# EAGLE design Schaltplan (EAGLE 7.2.0)
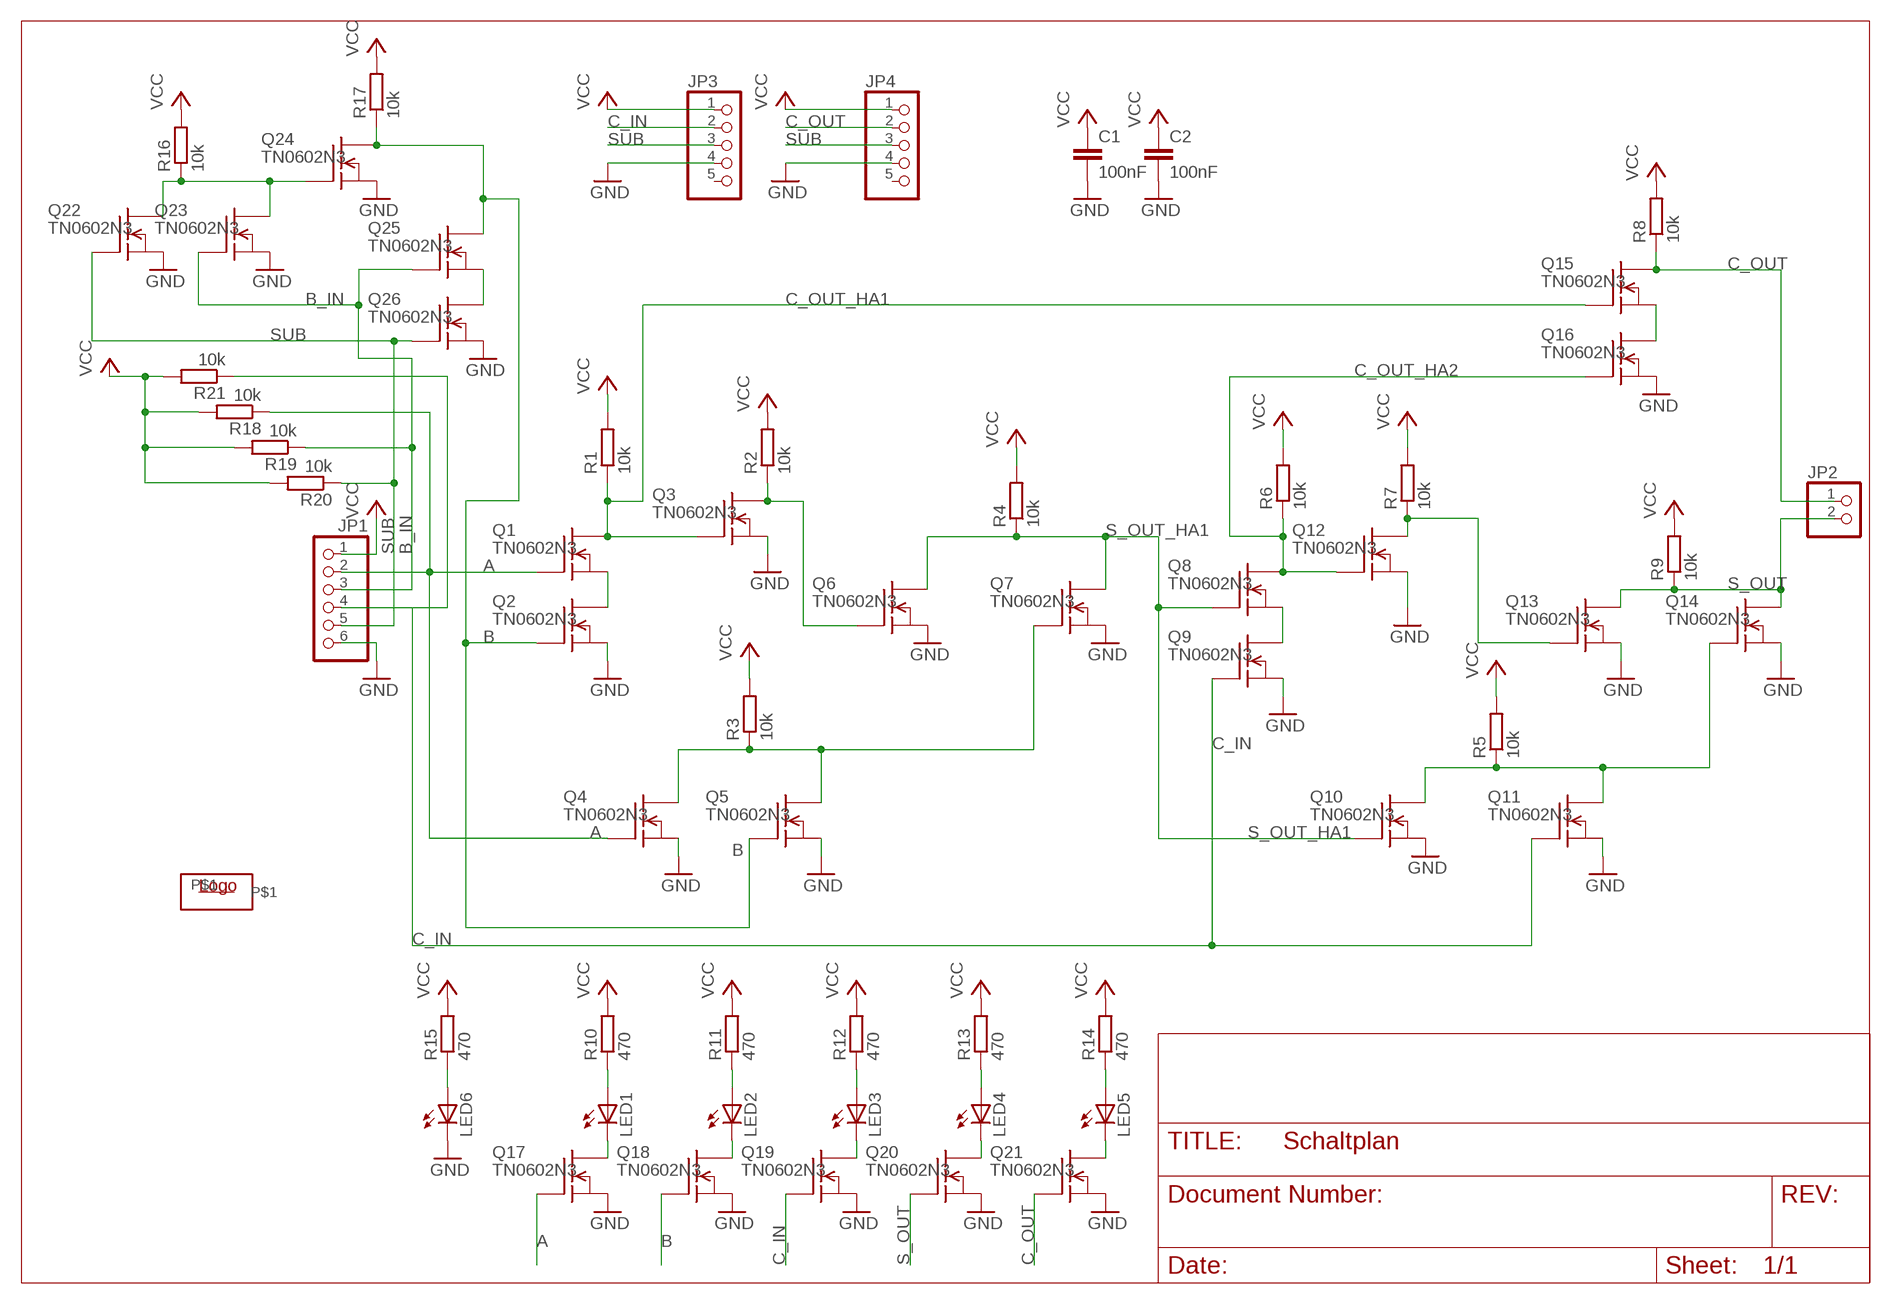
[diagram p0: schematic, sheet 1]

## Parts
C1  100nF  C-EU025-024X044  [C025-024X044]
C2  100nF  C-EU025-024X044  [C025-024X044]
JP1  PINHD-1X6  [1X06]
JP2  PINHD-1X2  [1X02]
JP3  PINHD-1X5  [1X05]
JP4  PINHD-1X5  [1X05]
LED1  LED3MM  [LED3MM]
LED2  LED3MM  [LED3MM]
LED3  LED3MM  [LED3MM]
LED4  LED3MM  [LED3MM]
LED5  LED3MM  [LED3MM]
LED6  LED3MM  [LED3MM]
Q1  TN0602N3  [TO-92]
Q2  TN0602N3  [TO-92]
Q3  TN0602N3  [TO-92]
Q4  TN0602N3  [TO-92]
Q5  TN0602N3  [TO-92]
Q6  TN0602N3  [TO-92]
Q7  TN0602N3  [TO-92]
Q8  TN0602N3  [TO-92]
Q9  TN0602N3  [TO-92]
Q10  TN0602N3  [TO-92]
Q11  TN0602N3  [TO-92]
Q12  TN0602N3  [TO-92]
Q13  TN0602N3  [TO-92]
Q14  TN0602N3  [TO-92]
Q15  TN0602N3  [TO-92]
Q16  TN0602N3  [TO-92]
Q17  TN0602N3  [TO-92]
Q18  TN0602N3  [TO-92]
Q19  TN0602N3  [TO-92]
Q20  TN0602N3  [TO-92]
Q21  TN0602N3  [TO-92]
Q22  TN0602N3  [TO-92]
Q23  TN0602N3  [TO-92]
Q24  TN0602N3  [TO-92]
Q25  TN0602N3  [TO-92]
Q26  TN0602N3  [TO-92]
R1  10k  R-EU_0204/2V  [0204V]
R2  10k  R-EU_0204/2V  [0204V]
R3  10k  R-EU_0204/2V  [0204V]
R4  10k  R-EU_0204/2V  [0204V]
R5  10k  R-EU_0204/2V  [0204V]
R6  10k  R-EU_0204/2V  [0204V]
R7  10k  R-EU_0204/2V  [0204V]
R8  10k  R-EU_0204/2V  [0204V]
R9  10k  R-EU_0204/2V  [0204V]
R10  470  R-EU_0204/2V  [0204V]
R11  470  R-EU_0204/2V  [0204V]
R12  470  R-EU_0204/2V  [0204V]
R13  470  R-EU_0204/2V  [0204V]
R14  470  R-EU_0204/2V  [0204V]
R15  470  R-EU_0204/2V  [0204V]
R16  10k  R-EU_0204/2V  [0204V]
R17  10k  R-EU_0204/2V  [0204V]
R18  10k  R-EU_M0805  [M0805]
R19  10k  R-EU_M0805  [M0805]
R20  10k  R-EU_M0805  [M0805]
R21  10k  R-EU_M0805  [M0805]
U$3  LOGO  [LOGO]

## Nets
A: JP1.2 Q1.2(G) Q4.2(G) Q17.2(G) R18.1
B: Q2.2(G) Q5.2(G) Q18.2(G) Q24.3(D) Q25.3(D) R17.1
B_IN: JP1.3 Q23.2(G) Q25.2(G) R19.1
C_IN: JP1.4 JP3.2 Q9.2(G) Q11.2(G) Q19.2(G) R21.1
C_OUT: JP2.1 JP4.2 Q15.3(D) Q21.2(G) R8.1
C_OUT_HA1: Q1.3(D) Q3.2(G) Q15.2(G) R1.1
C_OUT_HA2: Q8.3(D) Q12.2(G) Q16.2(G) R6.1
GND: C1.2 C2.2 JP1.6 JP3.4 JP4.4 LED6.K(C) Q2.1(S) Q3.1(S) Q4.1(S) Q5.1(S) Q6.1(S) Q7.1(S) Q9.1(S) Q10.1(S) Q11.1(S) Q12.1(S) Q13.1(S) Q14.1(S) Q16.1(S) Q17.1(S) Q18.1(S) Q19.1(S) Q20.1(S) Q21.1(S) Q22.1(S) Q23.1(S) Q24.1(S) Q26.1(S)
N$1: LED1.A R10.1
N$2: Q1.1(S) Q2.3(D)
N$3: Q3.3(D) Q6.2(G) R2.1
N$4: Q4.3(D) Q5.3(D) Q7.2(G) R3.1
N$5: LED1.K(C) Q17.3(D)
N$6: LED2.A R11.1
N$7: LED2.K(C) Q18.3(D)
N$8: LED3.A R12.1
N$9: LED3.K(C) Q19.3(D)
N$10: Q8.1(S) Q9.3(D)
N$11: Q12.3(D) Q13.2(G) R7.1
N$12: Q10.3(D) Q11.3(D) Q14.2(G) R5.1
N$13: LED4.A R13.1
N$14: Q15.1(S) Q16.3(D)
N$15: LED4.K(C) Q20.3(D)
N$16: LED5.A R14.1
N$17: LED5.K(C) Q21.3(D)
N$18: LED6.A R15.1
N$19: Q22.3(D) Q23.3(D) Q24.2(G) R16.1
N$21: Q25.1(S) Q26.3(D)
S_OUT: JP2.2 Q13.3(D) Q14.3(D) Q20.2(G) R9.1
S_OUT_HA1: Q6.3(D) Q7.3(D) Q8.2(G) Q10.2(G) R4.1
SUB: JP1.5 JP3.3 JP4.3 Q22.2(G) Q26.2(G) R20.1
VCC: C1.1 C2.1 JP1.1 JP3.1 JP4.1 R1.2 R2.2 R3.2 R4.2 R5.2 R6.2 R7.2 R8.2 R9.2 R10.2 R11.2 R12.2 R13.2 R14.2 R15.2 R16.2 R17.2 R18.2 R19.2 R20.2 R21.2
Unconnected: JP3.5 JP4.5 U$3.P$1

## Library data of the parts
C1 C2 = resistor:C-EU: CAPACITOR, European symbol
JP1 = pinhead:PINHD-1X6: PIN HEADER
JP2 = pinhead:PINHD-1X2: PIN HEADER
JP3 JP4 = pinhead:PINHD-1X5: PIN HEADER
LED1-LED6 = led:LED: LED OSRAM: - CHIPLED LG R971, LG N971, LY N971, LG Q971, LY Q971, LO R971, LY R971 LH N974, LH R974 LS Q976, LO Q976, LY Q976 LO Q996 - Hyper CHIPLED LW Q18S LB Q993, LB Q99A, LB R99A - SideLED LS A670, LO A670, LY A670, LG A670, LP A670 LB A673, LV A673, LT A673, LW A673 LH A674 LY A675 LS A676, LA A676, LO A676, LY A676, LW A676 LS A679, LY A679, LG A679 - Hyper Micro SIDELED® LS Y876, LA Y876, LO Y876, LY Y876 LT Y87S - SmartLED LW L88C, LW L88S LB L89C, LB L89S, LG L890 LS L89K, LO L89K, LY L89K LS L896, LA L896, LO L896, LY L896 - TOPLED LS T670, LO T670, LY T670, LG T670, LP T670 LSG T670, LSP T670, LSY T670, LOP T670, LYG T670 LG T671, LOG T671, LSG T671 LB T673, LV T673, LT T673, LW T673 LH T674 LS T676, LA T676, LO T676, LY T676, LB T676, LH T676, LSB T676, LW T676 LB T67C, LV T67C, LT T67C, LS T67K, LO T67K, LY T67K, LW E67C LS E67B, LA E67B, LO E67B, LY E67B, LB E67C, LV E67C, LT E67C LW T67C LS T679, LY T679, LG T679 LS T770, LO T770, LY T770, LG T770, LP T770 LB T773, LV T773, LT T773, LW T773 LH T774 LS E675, LA E675, LY E675, LS T675 LS T776, LA T776, LO T776, LY T776, LB T776 LHGB T686 LT T68C, LB T68C - Hyper Mini TOPLED® LB M676 - Mini TOPLED Santana® LG M470 LS M47K, LO M47K, LY M47K Source: http://www.osram.convergy.de LUXEON: - LUMILED® LXK2-PW12-R00, LXK2-PW12-S00, LXK2-PW14-U00, LXK2-PW14-V00 LXK2-PM12-R00, LXK2-PM12-S00, LXK2-PM14-U00 LXK2-PE12-Q00, LXK2-PE12-R00, LXK2-PE12-S00, LXK2-PE14-T00, LXK2-PE14-U00 LXK2-PB12-K00, LXK2-PB12-L00, LXK2-PB12-M00, LXK2-PB14-N00, LXK2-PB14-P00, LXK2-PB14-Q00 LXK2-PR12-L00, LXK2-PR12-M00, LXK2-PR14-Q00, LXK2-PR14-R00 LXK2-PD12-Q00, LXK2-PD12-R00, LXK2-PD12-S00 LXK2-PH12-R00, LXK2-PH12-S00 LXK2-PL12-P00, LXK2-PL12-Q00, LXK2-PL12-R00 Source: www.luxeon.com KINGBRIGHT: KA-3528ASYC Source: www.kingbright.com
Q1-Q26 = transistor-fet:TN0602N3: N-Channel Enhancement MOSFET 20V; 4A; 0,75Ohm
R1-R21 = resistor:R-EU_: RESISTOR, European symbol
U$3 = logo:LOGO

## Board
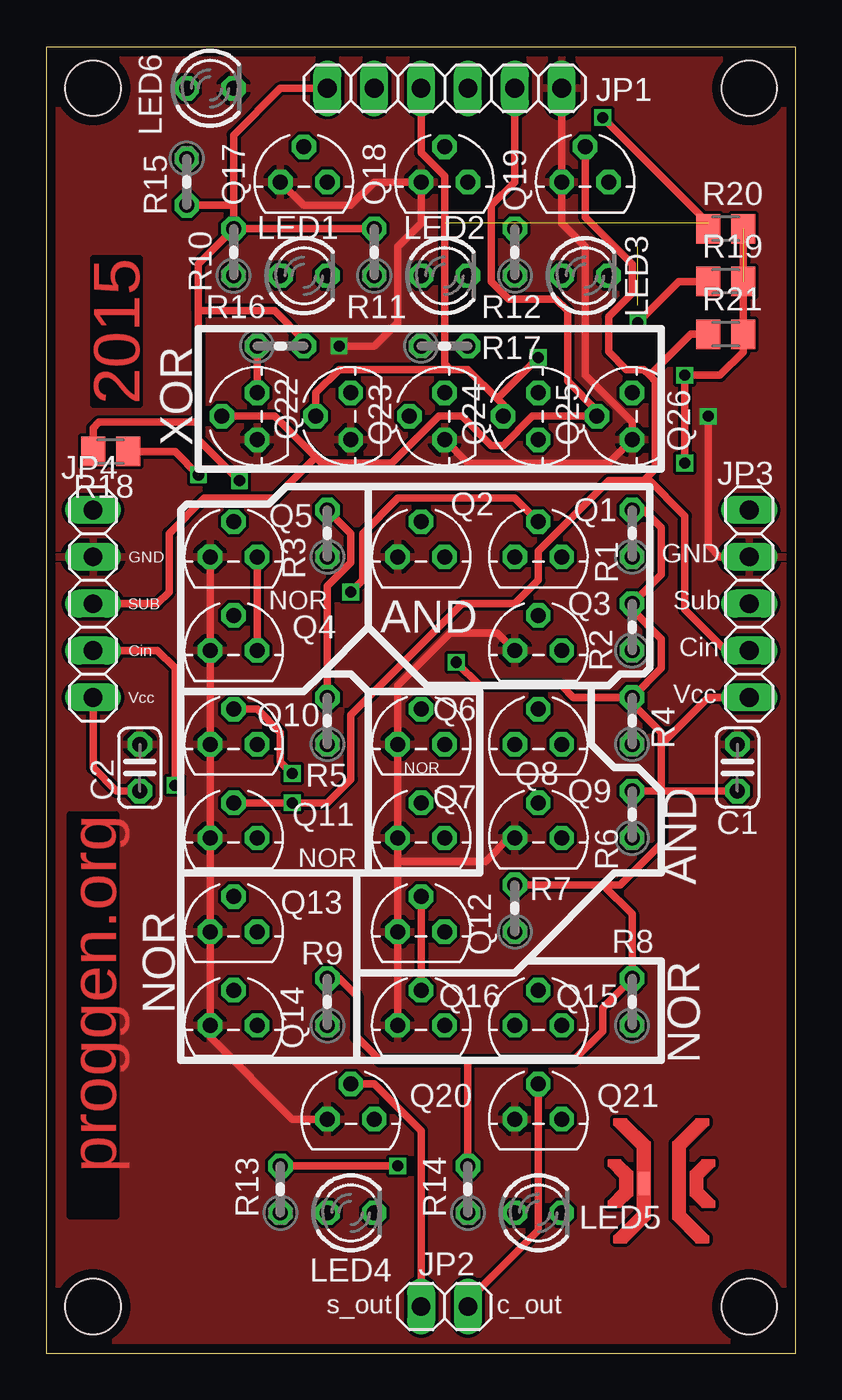
[diagram p1: board, top side]
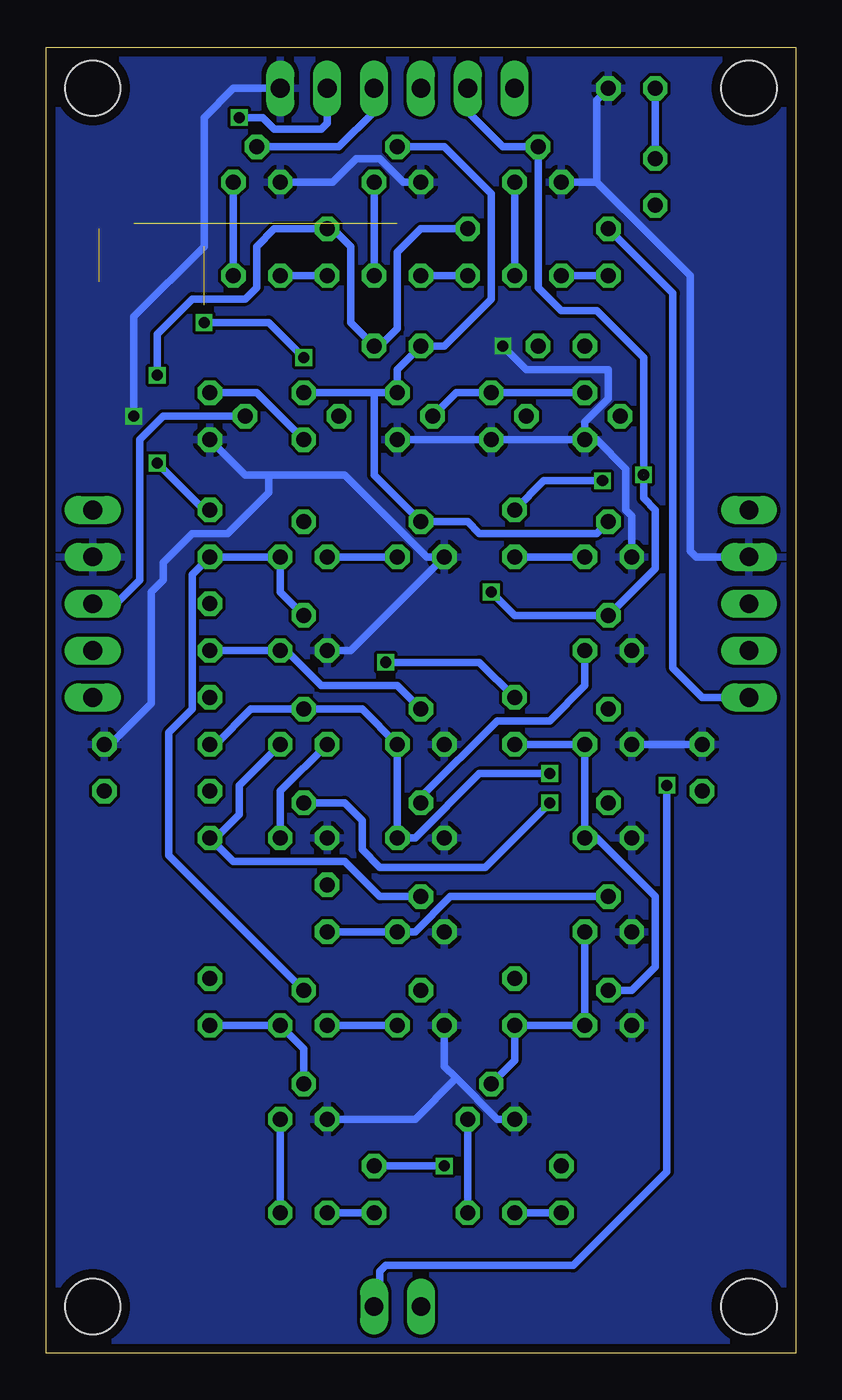
[diagram p2: board, bottom side, seen from below]

Size 40.63 x 70.79 mm. Coordinates in mm from the lower left corner, seen from the top.
Outline: 0,0 40.63,0 40.63,70.79 0,70.79 0,0
Copper layers (1*16): Top 0.035mm / dielectric 1.5mm / Bottom 0.035mm
Design rules "EagleRules": minimum track width 7mil, minimum drill 12mil, track to track 7mil, track to pad 7mil, pad to pad 7mil, via to via 7mil, smd to smd 0mil, copper to edge 20mil, drill to drill 10mil, minimum pad ring 10mil, minimum via ring 6mil, stop-mask expansion 2mil, vias tented up to drill 25mil, thermal gap 10mil
Holes 3 mm at 2.54,68.58 38.1,68.58 38.1,2.54 2.54,2.54

### Footprints (pad centres in the part's own frame; a part is rotated, then mirrored left to right if it is on the bottom)
C025-024X044 = drill 0.813 octagon: 1 -1.27,0; 2 1.27,0
1X06 = drill 1.016 long: 1 -6.35,0; 2 -3.81,0; 3 -1.27,0; 4 1.27,0; 5 3.81,0; 6 6.35,0
1X02 = drill 1.016 long: 1 -1.27,0; 2 1.27,0
1X05 = drill 1.016 long: 1 -5.08,0; 2 -2.54,0; 3 0,0; 4 2.54,0; 5 5.08,0
LED3MM = drill 0.813 octagon: A -1.27,0; K 1.27,0
TO-92 = drill 0.813 octagon: 1 -1.27,0; 2 0,1.905; 3 1.27,0
0204V = drill 0.813 octagon: 1 -1.27,0; 2 1.27,0
M0805 = smd 1.3 x 1.6: 1 -0.95,0; 2 0.95,0
LOGO = smd 0.635 x 1.27: P$1 -0.953,0

### Placement (x,y rotation side)
C1  37.46,31.75 90 top
C2  5.08,31.75 90 top
JP1  21.59,68.58 0 top
JP2  21.59,2.54 180 top
JP3  38.1,40.64 90 top
JP4  2.54,40.64 90 top
LED1  13.97,58.42 0 top
LED2  21.59,58.42 0 top
LED3  29.21,58.42 0 top
LED4  16.51,7.62 0 top
LED5  26.67,7.62 0 top
LED6  8.89,68.58 0 top
Q1  26.67,43.18 0 top
Q2  20.32,43.18 0 top
Q3  26.67,38.1 0 top
Q4  10.16,38.1 0 top
Q5  10.16,43.18 0 top
Q6  20.32,33.02 0 top
Q7  20.32,27.94 0 top
Q8  26.67,33.02 0 top
Q9  26.67,27.94 0 top
Q10  10.16,33.02 0 top
Q11  10.16,27.94 0 top
Q12  20.32,22.86 0 top
Q13  10.16,22.86 0 top
Q14  10.16,17.78 0 top
Q15  26.67,17.78 0 top
Q16  20.32,17.78 0 top
Q17  13.97,63.5 0 top
Q18  21.59,63.5 0 top
Q19  29.21,63.5 0 top
Q20  16.51,12.7 0 top
Q21  26.67,12.7 0 top
Q22  11.43,50.8 90 top
Q23  16.51,50.8 90 top
Q24  21.59,50.8 90 top
Q25  26.67,50.8 90 top
Q26  31.75,50.8 90 top
R1  31.75,44.45 90 top
R2  31.75,39.37 90 top
R3  15.24,44.45 90 top
R4  31.75,34.29 90 top
R5  15.24,34.29 90 top
R6  31.75,29.21 90 top
R7  25.4,24.13 90 top
R8  31.75,19.05 90 top
R9  15.24,19.05 90 top
R10  10.16,59.69 90 top
R11  17.78,59.69 90 top
R12  25.4,59.69 90 top
R13  12.7,8.89 90 top
R14  22.86,8.89 90 top
R15  7.62,63.5 270 top
R16  12.7,54.61 0 top
R17  21.59,54.61 0 top
R18  3.49,48.89 180 top
R19  36.83,58.1 0 top
R20  36.83,60.96 0 top
R21  36.83,55.25 0 top
U$3  33.34,9.21 0 top

### Tracks (layer width: path | path; a pad name or v marks a point on that pad's centre or on a via)
A  (via drill 0.6)  (1 unrouted)
  Top 0.406: Q1.2 25.4,46.35 19.05,46.35 17.15,44.45 17.15,41.91 v16.51,41.27 | R18.1 6.98,48.89 v8.26,47.62
  Bottom 0.406: JP1.2 17.78,67.31 15.88,65.41 Q17.2 13.97,57.78 12.7,56.52 10.8,56.52 8.26,53.98 v8.26,47.62 8.26,46.35 7.62,45.72 7.62,42.55 Q4.2 15.24,40.01 v16.51,41.27
B
  Bottom 0.406: Q25.3 22.86,52.07 | 22.86,52.07 Q24.3 21.59,53.34 R17.1 19.05,54.61 16.51,57.15 16.51,62.86 19.05,65.41 Q18.2 | Q5.2 10.8,44.45 17.15,44.45 17.78,45.09 Q2.2 22.86,47.62 22.86,52.07
B_IN  (via drill 0.6)  (1 unrouted)
  Top 0.406: Q23.2 14.61,52.07 15.88,53.34 21.91,53.34 | Q25.2 24.77,51.44 24.45,51.75 | 24.45,51.75 22.86,53.34 21.91,53.34 | JP1.3 20.32,65.09 21.59,63.82 21.59,53.66 21.91,53.34 | R19.1 34.29,58.1 v32.07,55.88 | v26.67,53.98 24.45,51.75
  Bottom 0.406: v32.07,55.88 28.58,55.88 v26.67,53.98
C_IN  (via drill 0.6)
  Top 0.406: v13.34,29.84 Q11.2 15.24,29.84 16.51,31.12 16.51,34.61 22.54,40.64 25.4,40.64 26.67,41.91 26.67,43.5 30.48,47.31 32.38,47.31 32.54,47.47 | 32.54,47.47 33.02,47.94 33.02,52.7 32.7,53.02 | Q19.2 29.21,61.59 31.75,59.05 31.75,57.47 30.48,56.2 30.48,54.29 31.43,53.34 32.38,53.34 32.7,53.02 | JP3.2 36.83,38.1 34.61,40.32 34.61,45.4 32.54,47.47 | R21.1 34.93,55.25 32.7,53.02
  Bottom 0.406: JP1.4 22.86,67.31 24.77,65.41 Q19.2 | Q9.2 24.45,29.84 23.49,28.89 23.49,27.3 22.54,26.35 16.83,26.35 v13.34,29.84
C_OUT  (via drill 0.6)
  Top 0.406: JP2.1 22.86,2.86 26.67,6.67 Q21.2 | JP4.2 6.03,38.1 6.98,37.15 v6.98,30.8
  Bottom 0.406: Q21.2 26.67,16.51 Q15.3 R8.1 | JP2.1 22.54,2.86 22.54,4.45 22.23,4.76 12.06,4.76 6.98,9.84 v6.98,30.8
C_OUT_HA1
  Bottom 0.406: Q3.2 27.94,41.27 Q1.3 R1.1 32.7,42.23 32.7,34.92 33.97,33.66 33.97,26.99 Q15.2
C_OUT_HA2
  Top 0.406: Q12.2 Q16.2
  Bottom 0.406: Q8.3 30.16,30.8 30.16,29.21 31.43,27.94 R6.1 30.48,26.67 24.45,26.67 22.54,24.77 Q12.2
GND  (via drill 0.6)  (1 unrouted)
  Top 0.406: Q24.1 22.86,48.26 30.48,48.26 Q26.1 31.75,50.48 29.21,53.02 29.21,60.01 27.94,61.28 Q19.1 JP1.6 | Q17.1 13.97,62.23 16.51,62.23 17.78,63.5 Q18.1 20.32,61.28 19.05,60.01 19.05,55.88 17.78,54.61 v15.88,54.61 | Q16.1 Q12.1 19.05,26.67 | Q5.1 Q4.1 Q10.1 Q11.1 Q13.1 Q14.1 8.89,17.14 13.34,12.7 Q20.1 | 19.05,26.67 Q7.1 Q6.1 19.05,36.2 21.91,39.05 24.45,39.05 Q3.1 | Q9.1 25.08,27.94 23.81,26.67 19.05,26.67 | JP3.4 36.51,43.18 35.88,43.81 v35.88,50.8
  Bottom 0.406: Q18.1 21.27,63.5 22.54,64.77 23.81,64.77 25.08,63.5 Q19.1 | Q3.1 24.13,38.1 Q2.1 20,43.18 24.45,47.62 28.58,47.62 | Q22.1 10.8,49.53 9.21,47.94 9.21,45.72 8.89,45.4 Q5.1 | 28.58,47.62 29.85,47.62 Q26.1 | Q20.1 16.19,12.7 18.41,14.92 | 18.41,14.92 19.05,15.56 Q16.1 | Q21.1 20.64,12.7 18.41,14.92 | 10.8,63.5 5.72,58.42 5.72,43.5 5.4,43.18 JP4.4 | 10.8,63.5 Q17.1 | 10.8,63.5 10.8,67.94 LED6.K | v15.88,54.61 14.61,53.34 10.16,53.34 10.16,51.75 11.43,50.48 Q22.1 | Q22.1 Q23.1 Q24.1 21.91,49.21 | C2.2 Q10.1 | C1.2 37.15,33.02 34.93,35.24 34.93,41.27 34.29,41.91 34.29,42.86 32.7,44.45 30.8,44.45 28.58,46.67 28.58,47.62 | JP1.6 30.48,68.58 32.07,66.99 32.07,60.01 35.88,56.2 v35.88,50.8
  pour Top: 0.32,0.32 0.32,70.48 40.32,70.48 40.32,0.32
  pour Bottom: 0.32,70.48 40.01,70.48 40.32,70.48 40.32,0.32 0.32,0.32
N$1
  Bottom 0.406: R10.1 LED1.A
N$2
  Bottom 0.406: Q2.3 Q1.1
N$3
  Bottom 0.406: R2.1 Q3.3 27.62,38.1 25.72,36.2 21.59,36.2 Q6.2
N$4
  Top 0.406: Q4.3 Q5.3
  Bottom 0.406: Q5.3 R3.1 | Q4.3 11.43,36.2 13.34,34.29 16.19,34.29 20.32,30.16 Q7.2
N$5
  Bottom 0.406: LED1.K Q17.3
N$6
  Bottom 0.406: R11.1 LED2.A
N$7
  Bottom 0.406: Q18.3 LED2.K
N$8
  Bottom 0.406: R12.1 LED3.A
N$9
  Bottom 0.406: LED3.K Q19.3
N$10
  Bottom 0.406: Q9.3 27.94,30.48 Q8.1
N$11
  Bottom 0.406: R7.1 Q12.3 20.64,22.86 18.73,24.77 Q13.2
N$12
  Bottom 0.406: R5.1 Q10.3 Q11.3 10.8,27.94 7.62,24.77 7.62,20.95 8.89,19.68 Q14.2
N$13
  Bottom 0.406: R13.1 LED4.A
N$14
  Bottom 0.406: Q16.3 Q15.1
N$15
  Bottom 0.406: Q20.3 LED4.K
N$16
  Bottom 0.406: R14.1 LED5.A
N$17
  Bottom 0.406: Q21.3 LED5.K
N$18
  Bottom 0.406: R15.1 LED6.A
N$19
  Top 0.406: R16.1 Q22.3
  Bottom 0.406: Q22.3 Q23.3 18.41,52.07 Q24.2
N$21
  Bottom 0.406: Q25.1 29.21,52.07 Q26.3
S_OUT
  Top 0.406: JP2.2 20.32,12.06 17.78,14.61 Q20.2
  Bottom 0.406: Q13.3 Q14.3 R9.1 15.24,15.88 Q20.2
S_OUT_HA1  (via drill 0.6)
  Top 0.406: Q10.2 11.43,34.92 12.7,33.66 12.7,32.07 v13.34,31.43
  Bottom 0.406: R4.1 31.43,33.02 29.53,34.92 Q8.2 23.49,34.92 Q6.3 Q7.3 20.64,27.94 17.15,31.43 v13.34,31.43
SUB  (via drill 0.6)
  Top 0.406: JP1.5 25.4,63.5 24.13,62.23 24.13,58.1 25.08,57.15 27.62,57.15 28.26,56.52 28.26,52.7 29.85,51.12 Q26.2 26.35,50.8 24.77,49.21 24.13,49.21 22.54,50.8 21.27,50.8 18.73,48.26 14.92,48.26 14.61,48.58 | Q22.2 12.38,50.8 14.61,48.58 | JP4.3 6.03,40.64 6.67,41.27 6.67,44.45 8.57,46.35 12.38,46.35 14.61,48.58 | v30.16,66.99 35.88,61.28 R20.1
  Bottom 0.406: JP3.3 36.83,40.64 35.56,41.91 35.56,49.53 34.29,50.8 Q26.2 | v30.16,66.99 28.89,66.99 28.26,66.36 25.72,66.36 25.4,66.67 JP1.5
VCC  (via drill 0.6)  (1 unrouted)
  Top 0.406: 8.26,56.52 8.26,59.05 R10.2 | JP1.1 12.7,68.58 10.16,66.04 10.16,62.23 | 10.16,62.23 R10.2 | R16.2 13.97,54.93 12.38,56.52 8.26,56.52 | R11.2 R10.2 | R4.2 33.34,37.15 33.34,38.73 31.75,40.32 R2.2 33.34,42.23 33.34,44.77 32.38,45.72 R1.2 | R4.2 31.75,35.24 33.34,33.66 33.34,33.02 | 33.34,33.02 33.34,30.48 | 33.34,30.48 33.34,27.62 31.12,25.4 30.16,25.4 | R9.2 15.88,20.32 16.83,19.37 16.83,17.14 18.1,15.88 22.86,15.88 | 22.86,15.88 28.58,15.88 30.16,17.46 30.16,18.73 R8.2 31.75,23.81 30.16,25.4 | R6.2 33.34,30.48 | R3.2 16.51,44.45 16.51,42.86 15.24,41.59 R5.2 | JP3.1 35.88,35.56 33.34,33.02 | 8.26,56.52 8.26,50.48 | 8.26,50.48 8.26,49.53 v10.48,47.31 | R15.2 10.16,62.23 | R14.2 22.86,15.88 | R4.2 28.58,35.56 27.94,36.2 23.49,36.2 v22.23,37.46 | v34.61,48.26 v34.61,53.02 36.51,53.02 37.78,54.29 R21.2 R20.2 | C1.1 33.34,30.48 | C2.1 3.81,30.48 2.54,31.75 JP4.1 | R7.2 30.16,25.4 | R13.2 v19.05,10.16 | R18.2 2.54,50.17 2.86,50.48 8.26,50.48
  Bottom 0.406: R11.2 20.32,60.96 21.59,59.69 21.59,55.56 22.54,54.61 R17.2 24.13,55.88 24.13,60.01 25.08,60.96 R12.2 28.26,60.96 29.21,60.01 29.21,57.78 29.85,57.15 32.7,57.15 34.61,55.25 v34.61,53.02 | R3.2 13.65,47.31 v10.48,47.31 | JP4.1 5.08,35.56 6.67,37.15 6.67,57.47 R10.2 | v22.23,37.46 17.15,37.46 R5.2 | R1.2 32.07,45.72 v34.61,48.26 | v19.05,10.16 R14.2

### Text on the board
Top: 2015 | proggen.org
tPlace: XOR | GND | GND | SUB | NOR | Sub | AND | Cin | Cin | Vcc | Vcc | NOR | NOR | AND | NOR | NOR | s_out | c_out